# Altium schematic sheet BIMUDB-EHDW-01.SchDoc: <page title>
size Letter; Author: JRL; Organization: Engenuics Technologies Inc; Address1: 1835 19 Avenue NW; Address2: Calgary, AB  T2M 1B6; Address3: CANADA; Address4: 1-403-998-1422; DocumentNumber: <PPPP-DTTT->; Revision: <###>; SheetNumber: <x>; SheetTotal: <y>
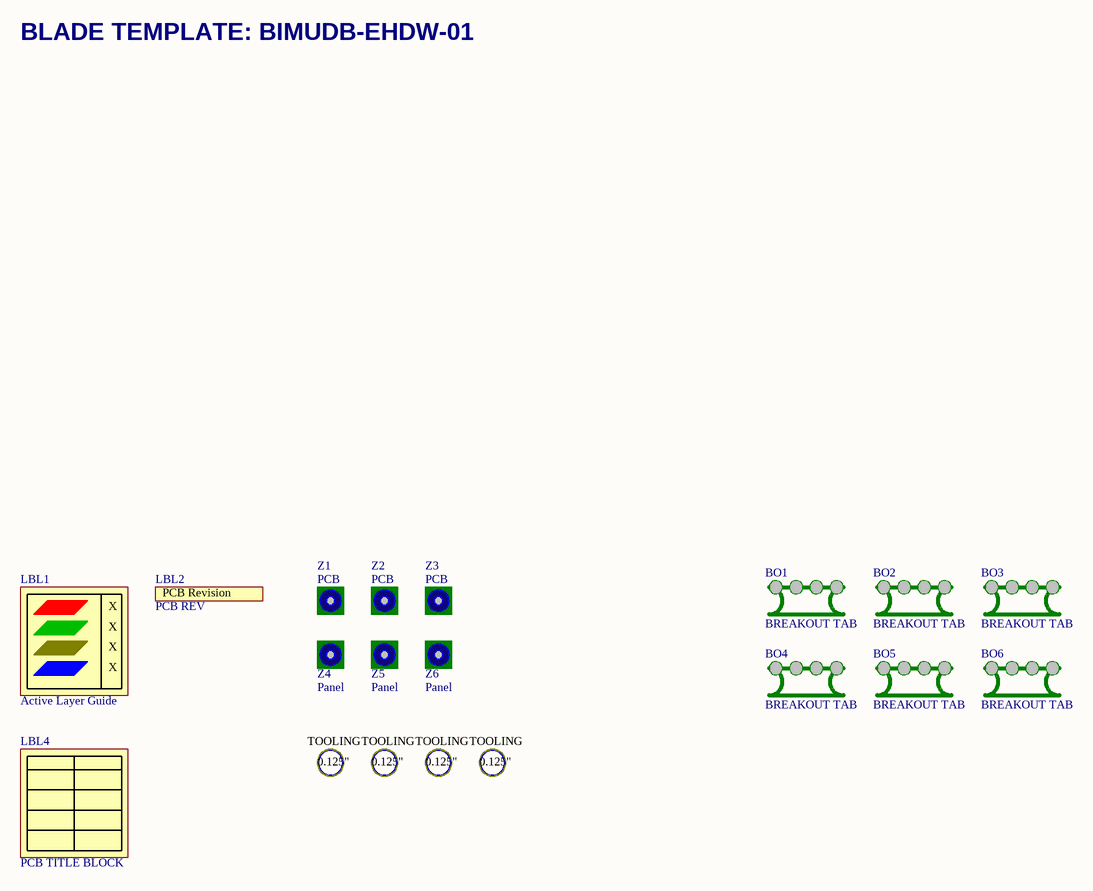
[diagram p0: BIMUDB-EHDW-01.SchDoc]

## Parts
BO1  BREAKOUT TAB  [BREAKOUT 4-HOLE 4MM]
BO2  BREAKOUT TAB  [BREAKOUT 4-HOLE 4MM]
BO3  BREAKOUT TAB  [BREAKOUT 4-HOLE 4MM]
BO4  BREAKOUT TAB  [BREAKOUT 4-HOLE 4MM]
BO5  BREAKOUT TAB  [BREAKOUT 4-HOLE 4MM]
BO6  BREAKOUT TAB  [BREAKOUT 4-HOLE 4MM]
LBL1  Active Layer Guide  [LABEL PCB ACTIVE LAYERS VERTICAL]
LBL2  PCB REV  [LABEL PCB REVISION BLADE]
LBL4  PCB TITLE BLOCK  [LABEL PCB Title Block]
Z1  PCB  [FIDUCIAL PCB]
Z2  PCB  [FIDUCIAL PCB]
Z3  PCB  [FIDUCIAL PCB]
Z4  Panel  [FIDUCIAL PANEL]
Z5  Panel  [FIDUCIAL PANEL]
Z6  Panel  [FIDUCIAL PANEL]
Z7  LABEL PANEL TOOL HOLE  [TOOLING HOLE 125MIL]  (value not drawn)
Z8  LABEL PANEL TOOL HOLE  [TOOLING HOLE 125MIL]  (value not drawn)
Z9  LABEL PANEL TOOL HOLE  [TOOLING HOLE 125MIL]  (value not drawn)
Z10  LABEL PANEL TOOL HOLE  [TOOLING HOLE 125MIL]  (value not drawn)

## Notes on the sheet
- BLADE TEMPLATE: BIMUDB-EHDW-01
- 1835 19 AVE NW
- Calgary, AB  T2M 1B6
- Title:
- Number:
- Date:
- Version
- Sheet:
- of
- Author:
- Revision
- History
- Description / Change Summary
- Date Released
- Approved By
- 1-403-998-1422
- File:
- (in symbol LABEL PANEL TOOL HOLE) TOOLING; 0.125"
- (in symbol LABEL PCB ACTIVE LAYERS) X
- (in symbol LABEL PCB REVISION) PCB Revision

## Library data of the parts
BO1-BO6 = BREAKOUT TAB: 7. Modified By: JRL; 1. Description: BREAKOUT TAB; 2. Manufacturer: N/A; 3. Manufacturer Part Number: N/A; 4. Digi-Key Part Number: N/A; 5. Internal Part Number: N/A; 6. Last Modified: June 18, 2008
LBL1 = LABEL PCB ACTIVE LAYERS: 1. Description: LABEL PCB ACTIVE LAYERS; 2. Manufacturer: N/A; 3. Manufacturer Part Number: N/A; 4. Digi-Key Part Number: N/A; 5. Internal Part Number: N/A; 6. Last Modified: *; 7. Modified By: *
LBL2 = LABEL PCB REVISION: 1. Description: LABEL PCB ENGENUICS; 7. Modified By: JRL; 2. Manufacturer: N/A; 3. Manufacturer Part Number: N/A; 4. Digi-Key Part Number: N/A; 5. Internal Part Number: N/A; 6. Last Modified: June 30, 2008
LBL4 = LABEL PCB TITLE BLOCK: 7. Modified By: JRL; 1. Description: LABEL PCB TITLE BLOCK; 2. Manufacturer: N/A; 3. Manufacturer Part Number: N/A; 4. Digi-Key Part Number: N/A; 5. Internal Part Number: N/A; 6. Last Modified: June 30, 2008
Z1-Z3 = FIDUCIAL PCB: 1. Description: FIDUCIAL SINGLE LAYER PADS ONLY; 7. Modified By: JRL; 2. Manufacturer: *; 3. Manufacturer Part Number: *; 4. Digi-Key Part Number: *; 5. Internal Part Number: *; 6. Last Modified: 2011-04-17
Z4-Z6 = FIDUCIAL PANEL: 1. Description: FIDUCIAL MULTI LAYER PAD ONLY; 7. Modified By: JRL; 2. Manufacturer: *; 3. Manufacturer Part Number: *; 4. Digi-Key Part Number: *; 5. Internal Part Number: *; 6. Last Modified: 2011-04-17
Z7-Z10 = LABEL PANEL TOOL HOLE: 1. Description: *; 2. Manufacturer: *; 3. Manufacturer Part Number: *; 4. Digi-Key Part Number: *; 5. Internal Part Number: *; 6. Last Modified: *; 7. Modified By: *